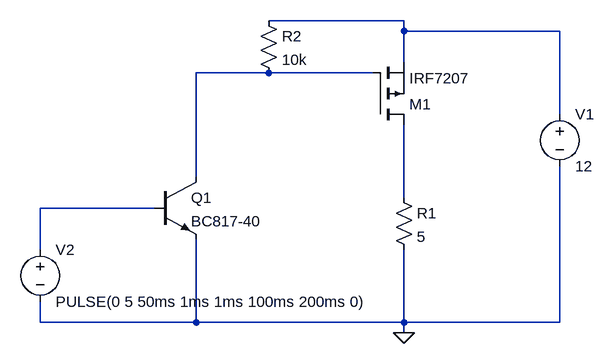
[diagram p0: schematic Draft3.asc]
Draft3.asc, the LTspice schematic file:
Version 4
SHEET 1 880 680
WIRE 480 -160 272 -160
WIRE 480 -144 480 -160
WIRE 720 -144 480 -144
WIRE 480 -96 480 -144
WIRE 272 -80 160 -80
WIRE 432 -80 272 -80
WIRE 720 -16 720 -144
WIRE 160 80 160 -80
WIRE 480 112 480 0
WIRE 96 128 -80 128
WIRE -80 192 -80 128
WIRE -80 304 -80 272
WIRE 160 304 160 176
WIRE 160 304 -80 304
WIRE 480 304 480 192
WIRE 480 304 160 304
WIRE 720 304 720 64
WIRE 720 304 480 304
WIRE 480 320 480 304
FLAG 480 320 0
SYMBOL pmos 432 0 M180
SYMATTR InstName M1
SYMATTR Value IRF7207
SYMBOL voltage 720 -32 R0
WINDOW 123 0 0 Left 0
WINDOW 39 0 0 Left 0
SYMATTR InstName V1
SYMATTR Value 12
SYMBOL res 464 96 R0
SYMATTR InstName R1
SYMATTR Value 5
SYMBOL res 256 -176 R0
SYMATTR InstName R2
SYMATTR Value 10k
SYMBOL npn 96 80 R0
SYMATTR InstName Q1
SYMATTR Value BC817-40
SYMBOL voltage -80 176 R0
WINDOW 123 0 0 Left 0
WINDOW 39 0 0 Left 0
SYMATTR InstName V2
SYMATTR Value PULSE(0 5 50ms 1ms 1ms 100ms 200ms 0)

The netlist it stands for:
* Draft3.asc
M1 N003 N002 N001 N001 IRF7207
V1 N001 0 12
R1 N003 0 5
R2 N001 N002 10k
Q1 N002 N004 0 0 BC817-40
V2 N004 0 PULSE(0 5 50ms 1ms 1ms 100ms 200ms 0)
.model NPN NPN
.model PNP PNP
.lib standard.bjt
.model NMOS NMOS
.model PMOS PMOS
.lib standard.mos
.backanno
.end